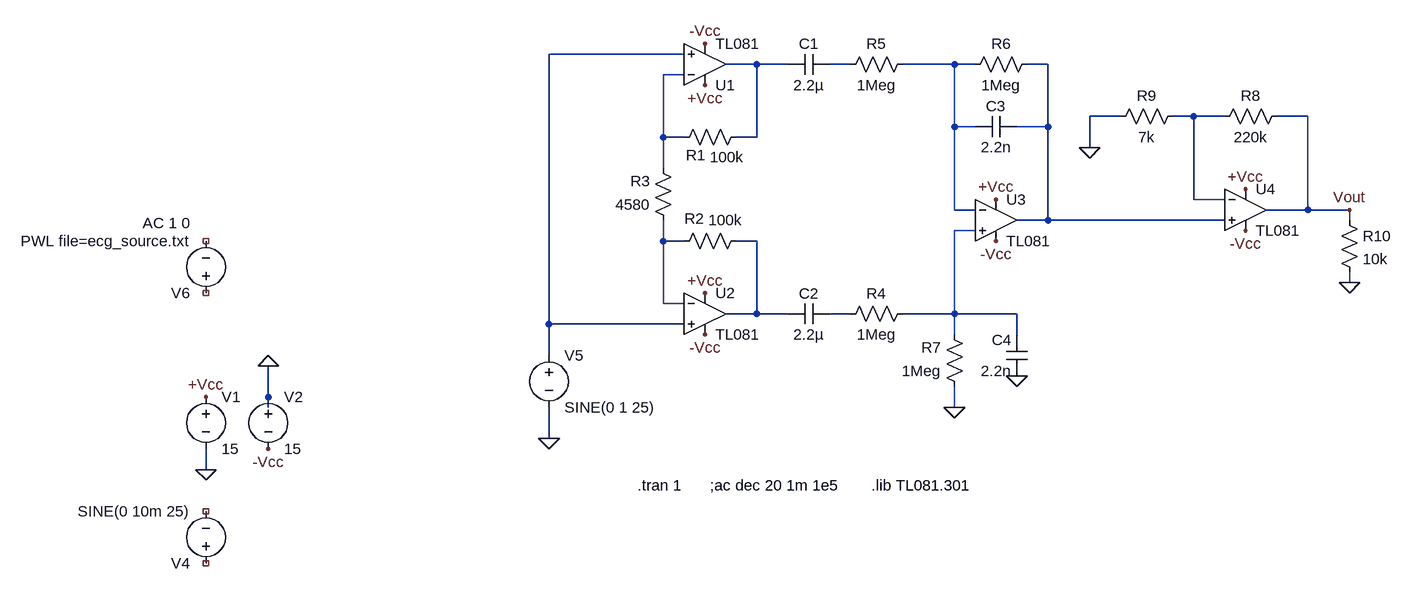
[diagram p0: schematic Amplificador Instrumentacion.asc]
Amplificador Instrumentacion.asc, the LTspice schematic file:
Version 4
SHEET 1 1140 1152
WIRE -448 -80 -656 -80
WIRE -336 -64 -384 -64
WIRE -288 -64 -336 -64
WIRE -192 -64 -224 -64
WIRE -32 -64 -112 -64
WIRE 0 -64 -32 -64
WIRE 112 -64 80 -64
WIRE -448 -48 -480 -48
WIRE 224 16 176 16
WIRE 336 16 304 16
WIRE 384 16 336 16
WIRE 512 16 464 16
WIRE -32 32 -32 -64
WIRE 0 32 -32 32
WIRE 112 32 112 -64
WIRE 112 32 64 32
WIRE -480 48 -480 -48
WIRE -448 48 -480 48
WIRE -336 48 -336 -64
WIRE -336 48 -368 48
WIRE 176 64 176 16
WIRE -480 96 -480 48
WIRE 336 144 336 16
WIRE 384 144 336 144
WIRE -32 160 -32 32
WIRE 0 160 -32 160
WIRE 512 160 512 16
WIRE 512 160 448 160
WIRE 576 160 512 160
WIRE 112 176 112 32
WIRE 112 176 64 176
WIRE 384 176 112 176
WIRE 576 176 576 160
WIRE 0 192 -32 192
WIRE -480 208 -480 176
WIRE -448 208 -480 208
WIRE -336 208 -368 208
WIRE 576 272 576 256
WIRE -480 304 -480 208
WIRE -448 304 -480 304
WIRE -336 320 -336 208
WIRE -336 320 -384 320
WIRE -288 320 -336 320
WIRE -192 320 -224 320
WIRE -32 320 -32 192
WIRE -32 320 -112 320
WIRE 64 320 -32 320
WIRE -656 336 -656 -80
WIRE -448 336 -656 336
WIRE -32 352 -32 320
WIRE 64 352 64 320
WIRE -656 384 -656 336
WIRE -1088 448 -1088 400
WIRE -1088 464 -1088 448
WIRE -32 464 -32 432
WIRE -656 512 -656 464
WIRE -1184 560 -1184 528
FLAG -1184 560 0
FLAG -1088 400 0
FLAG -32 464 0
FLAG 64 416 0
FLAG 176 64 0
FLAG -1184 448 +Vcc
FLAG -416 -32 +Vcc
FLAG -416 288 +Vcc
FLAG 32 144 +Vcc
FLAG 416 128 +Vcc
FLAG -416 -96 -Vcc
FLAG -416 352 -Vcc
FLAG 32 208 -Vcc
FLAG 416 192 -Vcc
FLAG -1088 528 -Vcc
FLAG 576 272 0
FLAG 576 160 Vout
FLAG -656 512 0
SYMBOL voltage -1184 432 R0
WINDOW 123 0 0 Left 0
WINDOW 39 0 0 Left 0
SYMATTR InstName V1
SYMATTR Value 15
SYMBOL voltage -1088 432 R0
WINDOW 123 0 0 Left 0
WINDOW 39 0 0 Left 0
SYMATTR InstName V2
SYMATTR Value 15
SYMBOL OpAmps\\opamp2 -416 0 M180
SYMATTR InstName U1
SYMATTR Value TL081
SYMBOL OpAmps\\opamp2 -416 256 R0
SYMATTR InstName U2
SYMATTR Value TL081
SYMBOL OpAmps\\opamp2 32 112 R0
SYMATTR InstName U3
SYMATTR Value TL081
SYMBOL res -352 32 R90
WINDOW 0 59 78 VBottom 2
WINDOW 3 31 30 VTop 2
SYMATTR InstName R1
SYMATTR Value 100k
SYMBOL res -352 192 R90
WINDOW 0 -3 80 VBottom 2
WINDOW 3 -32 32 VTop 2
SYMATTR InstName R2
SYMATTR Value 100k
SYMBOL res -464 192 R180
WINDOW 0 36 76 Left 2
WINDOW 3 36 40 Left 2
SYMATTR InstName R3
SYMATTR Value 4580
SYMBOL cap -224 -80 R90
WINDOW 0 0 32 VBottom 2
WINDOW 3 32 32 VTop 2
SYMATTR InstName C1
SYMATTR Value 2.2µ
SYMBOL cap -224 304 R90
WINDOW 0 0 32 VBottom 2
WINDOW 3 32 32 VTop 2
SYMATTR InstName C2
SYMATTR Value 2.2µ
SYMBOL res -96 304 R90
WINDOW 0 0 56 VBottom 2
WINDOW 3 32 56 VTop 2
SYMATTR InstName R4
SYMATTR Value 1Meg
SYMBOL res -96 -80 R90
WINDOW 0 0 56 VBottom 2
WINDOW 3 32 56 VTop 2
SYMATTR InstName R5
SYMATTR Value 1Meg
SYMBOL res 96 -80 R90
WINDOW 0 0 56 VBottom 2
WINDOW 3 32 56 VTop 2
SYMATTR InstName R6
SYMATTR Value 1Meg
SYMBOL cap 64 16 R90
WINDOW 0 0 32 VBottom 2
WINDOW 3 32 32 VTop 2
SYMATTR InstName C3
SYMATTR Value 2.2n
SYMBOL res -16 448 R180
WINDOW 0 36 76 Left 2
WINDOW 3 36 40 Left 2
SYMATTR InstName R7
SYMATTR Value 1Meg
SYMBOL cap 80 416 R180
WINDOW 0 24 56 Left 2
WINDOW 3 24 8 Left 2
SYMATTR InstName C4
SYMATTR Value 2.2n
SYMBOL OpAmps\\opamp2 416 96 R0
SYMATTR InstName U4
SYMATTR Value TL081
SYMBOL res 480 0 R90
WINDOW 0 0 56 VBottom 2
WINDOW 3 32 56 VTop 2
SYMATTR InstName R8
SYMATTR Value 220k
SYMBOL res 320 0 R90
WINDOW 0 0 56 VBottom 2
WINDOW 3 32 56 VTop 2
SYMATTR InstName R9
SYMATTR Value 7k
SYMBOL res 560 160 R0
SYMATTR InstName R10
SYMATTR Value 10k
SYMBOL voltage -1184 720 R180
WINDOW 123 0 0 Left 0
WINDOW 39 0 0 Left 0
SYMATTR InstName V4
SYMATTR Value SINE(0 10m 25)
SYMBOL voltage -656 368 R0
WINDOW 123 0 0 Left 0
WINDOW 39 0 0 Left 0
SYMATTR InstName V5
SYMATTR Value SINE(0 1 25)
SYMBOL voltage -1184 304 R180
WINDOW 123 24 124 Left 2
WINDOW 39 0 0 Left 0
SYMATTR Value2 AC 1 0
SYMATTR InstName V6
SYMATTR Value PWL file=ecg_source.txt
TEXT -160 584 Left 2 !.lib TL081.301
TEXT -520 584 Left 2 !.tran 1
TEXT -408 584 Left 2 !;ac dec 20 1m 1e5

The netlist it stands for:
* Amplificador Instrumentacion.asc
V1 +Vcc 0 15
V2 0 -Vcc 15
XU1 N001 N006 +Vcc -Vcc N002 TL081  ; pins In+ In- V+ V- OUT
XU2 N001 N009 +Vcc -Vcc N010 TL081  ; pins In+ In- V+ V- OUT
XU3 N008 N004 +Vcc -Vcc N005 TL081  ; pins In+ In- V+ V- OUT
R1 N002 N006 100k
R2 N010 N009 100k
R3 N009 N006 4580
C1 N003 N002 2.2µ
C2 N011 N010 2.2µ
R4 N008 N011 1Meg
R5 N004 N003 1Meg
R6 N005 N004 1Meg
C3 N005 N004 2.2n
R7 0 N008 1Meg
C4 0 N008 2.2n
XU4 N005 N007 +Vcc -Vcc Vout TL081  ; pins In+ In- V+ V- OUT
R8 Vout N007 220k
R9 N007 0 7k
R10 Vout 0 10k
V4 NC_01 NC_02 SINE(0 10m 25)
V5 N001 0 SINE(0 1 25)
V6 NC_03 NC_04 PWL file=ecg_source.txt AC 1 0
.lib TL081.301
.tran 1
;ac dec 20 1m 1e5
.backanno
.end